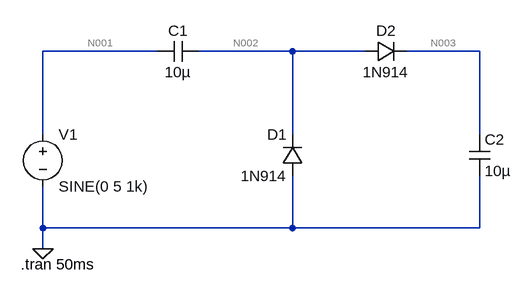
[diagram p0: schematic podvoyuvach.asc]
podvoyuvach.asc, the LTspice schematic file:
Version 4
SHEET 1 880 680
WIRE 192 0 16 0
WIRE 400 0 256 0
WIRE 512 0 400 0
WIRE 688 0 576 0
WIRE 16 128 16 0
WIRE 400 128 400 0
WIRE 688 128 688 0
WIRE 16 272 16 208
WIRE 400 272 400 192
WIRE 400 272 16 272
WIRE 688 272 688 192
WIRE 688 272 400 272
WIRE 16 304 16 272
FLAG 16 304 0
SYMBOL voltage 16 112 R0
WINDOW 123 0 0 Left 2
WINDOW 39 0 0 Left 2
SYMATTR InstName V1
SYMATTR Value SINE(0 5 1k)
SYMBOL cap 256 -16 R90
WINDOW 0 0 32 VBottom 2
WINDOW 3 32 32 VTop 2
SYMATTR InstName C1
SYMATTR Value 10µ
SYMBOL diode 416 192 R180
WINDOW 0 24 64 Left 2
WINDOW 3 24 0 Left 2
SYMATTR InstName D1
SYMATTR Value 1N914
SYMBOL diode 512 16 R270
WINDOW 0 32 32 VTop 2
WINDOW 3 0 32 VBottom 2
SYMATTR InstName D2
SYMATTR Value 1N914
SYMBOL cap 672 128 R0
SYMATTR InstName C2
SYMATTR Value 10µ
TEXT -18 328 Left 2 !.tran 50ms

The netlist it stands for:
* podvoyuvach.asc
V1 N001 0 SINE(0 5 1k)
C1 N002 N001 10µ
D1 0 N002 1N914
D2 N002 N003 1N914
C2 N003 0 10µ
.model D D
.lib standard.dio
.tran 50ms
.backanno
.end

* Results of the author's LTspice run, read from the files saved beside the schematic
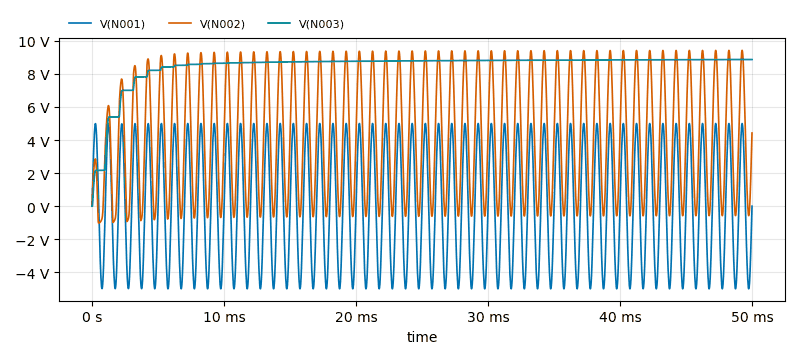
[diagram p1: Transient Analysis of podvoyuvach.asc, plotted from the saved traces]
* Transient Analysis, 1 run:
*   V(N001): min -4.998 V, max 4.998 V, average -294.1 µV, rms 3.518 V, last 0 V
*   V(N002): min -1.022 V, max 9.421 V, average 4.23 V, rms 5.498 V, last 4.426 V
*   V(N003): min 0 V, max 8.867 V, average 8.484 V, rms 8.558 V, last 8.867 V